# EAGLE design io-pack-2-1 (EAGLE 7.6.0)
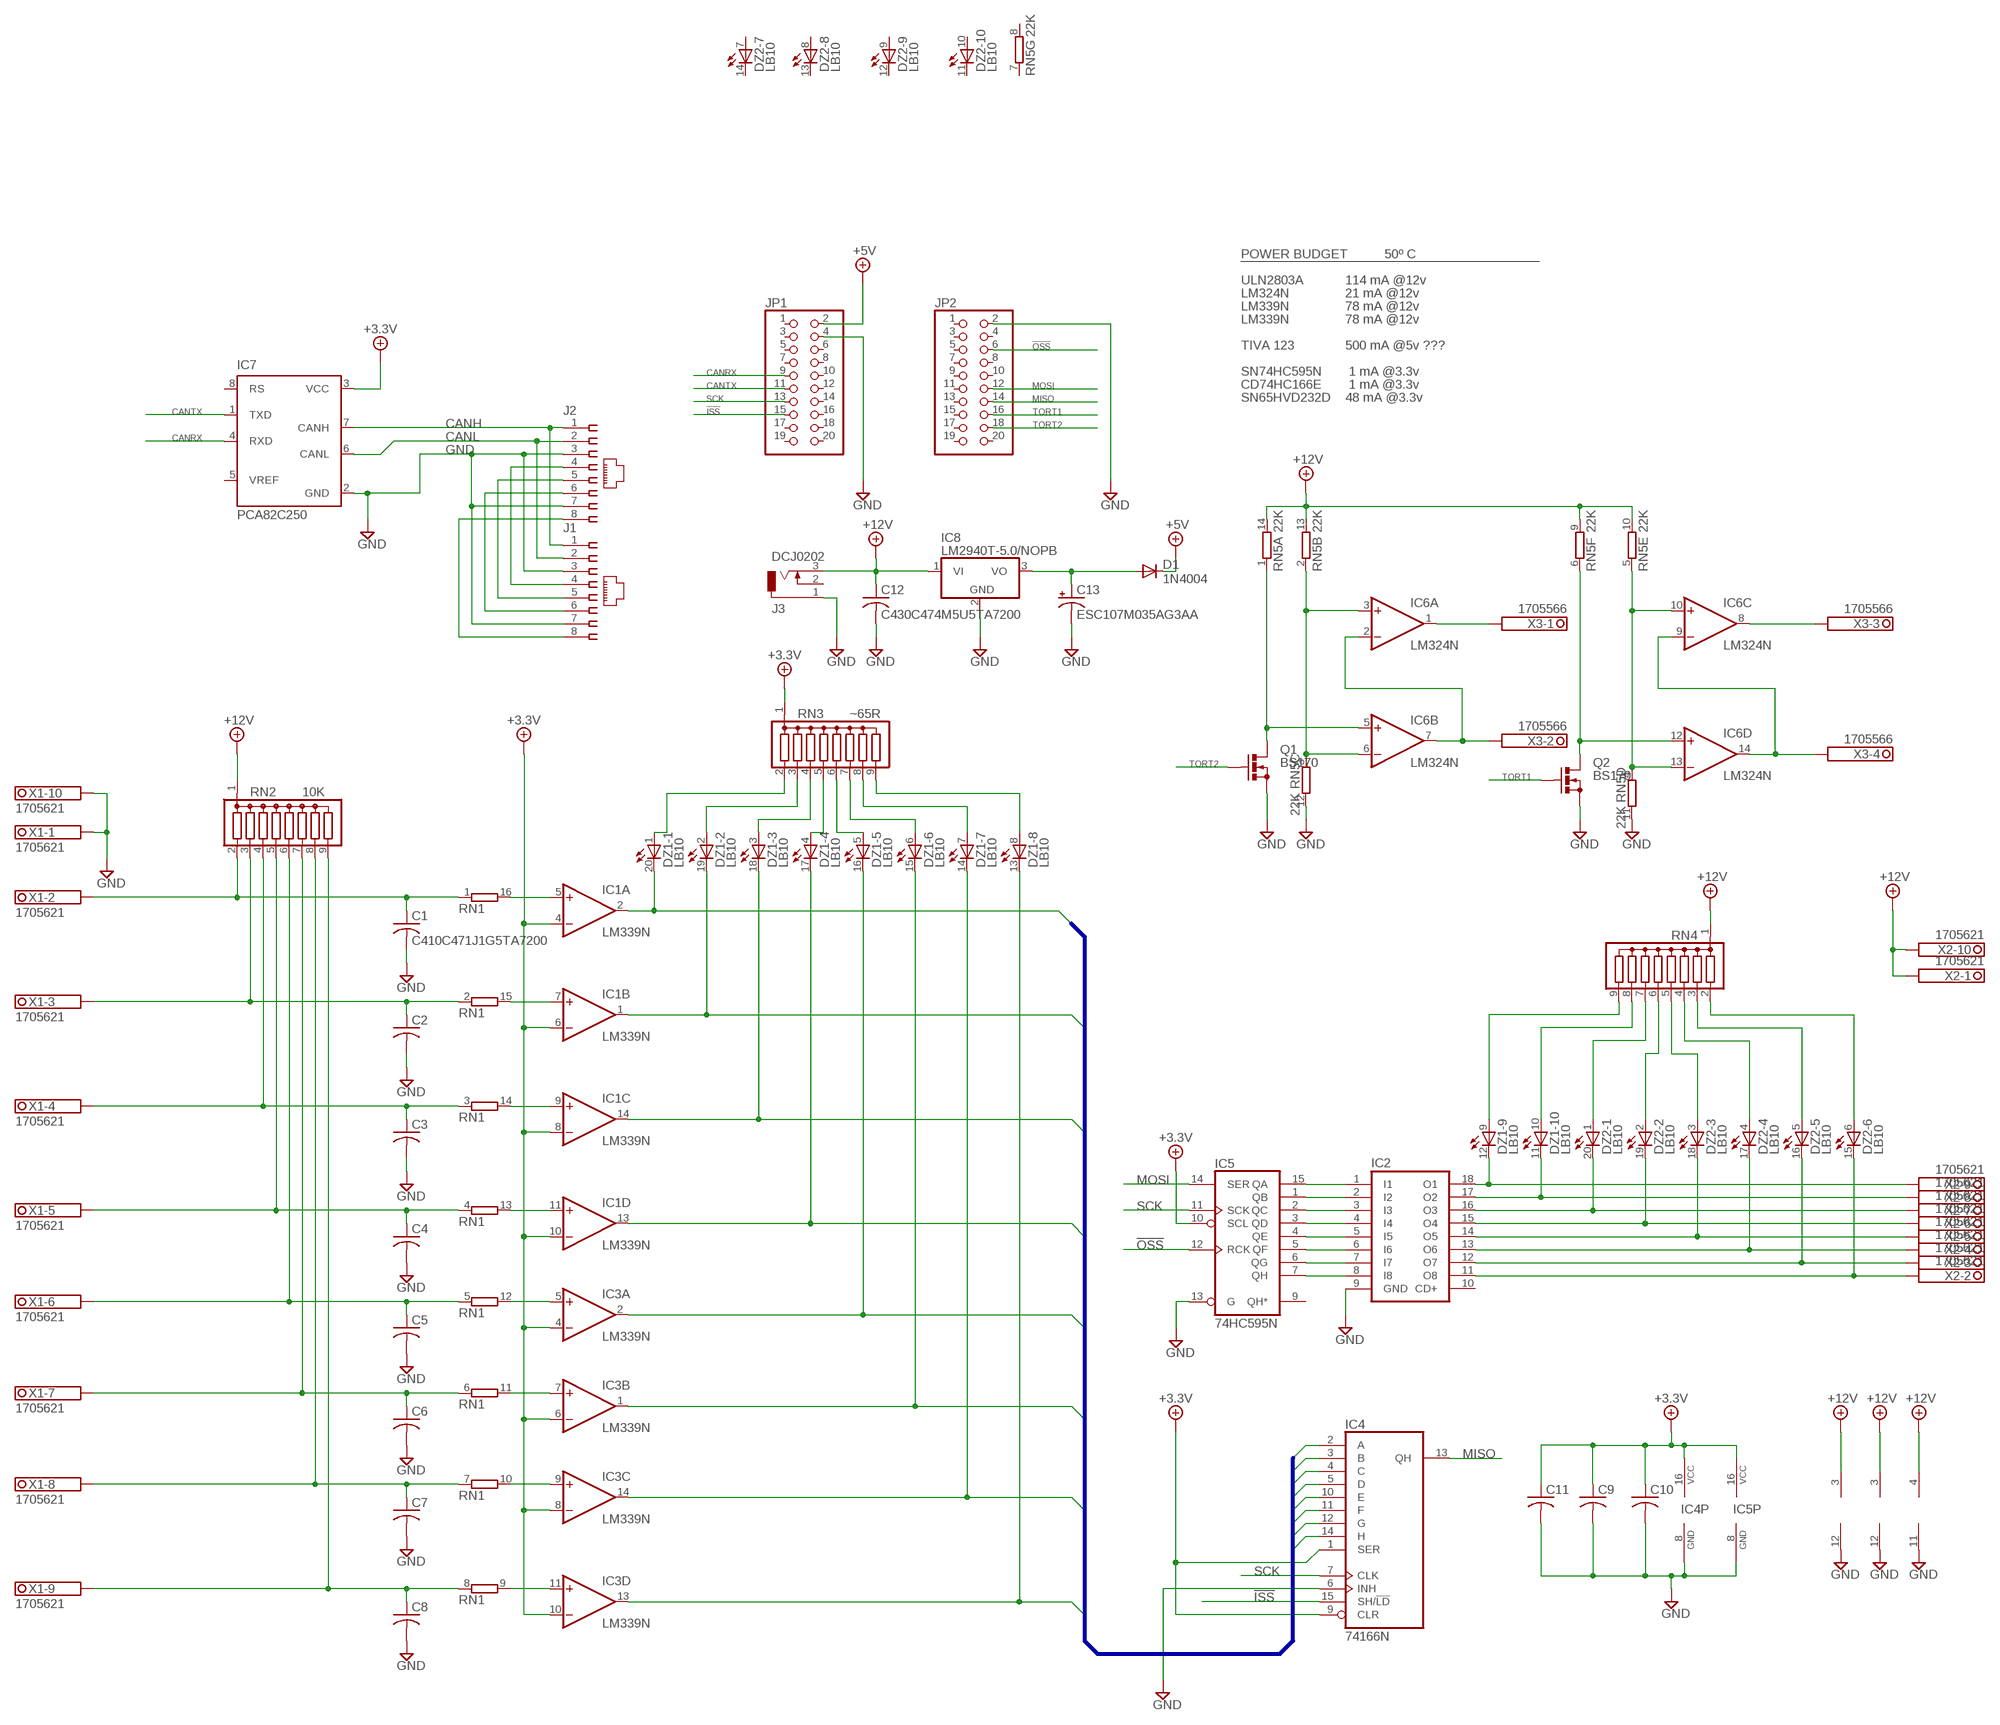
[diagram p0: schematic, sheet 1]

## Parts
C1  C410C471J1G5TA7200  C-US050-025X075  [C050-025X075]
C2  C-US050-025X075  [C050-025X075]
C3  C-US050-025X075  [C050-025X075]
C4  C-US050-025X075  [C050-025X075]
C5  C-US050-025X075  [C050-025X075]
C6  C-US050-025X075  [C050-025X075]
C7  C-US050-025X075  [C050-025X075]
C8  C-US050-025X075  [C050-025X075]
C9  C-US050-025X075  [C050-025X075]
C10  C-US050-025X075  [C050-025X075]
C11  C-US050-025X075  [C050-025X075]
C12  C430C474M5U5TA7200  C-US075-032X103  [C075-032X103]
C13  ESC107M035AG3AA  CPOL-USE3.5-8  [E3,5-8]
D1  1N4004  [DO41-10]
DZ1  LB10  [LB10]
DZ2  LB10  [LB10]
IC1  LM339N  [DIL14]
IC2  ULN2803A  [DIL18]
IC3  LM339N  [DIL14]
IC4  74166N  [DIL16]
IC5  74HC595N  74LS595N  [DIL16]
IC6  LM324N  [DIL14]
IC7  PCA82C250  [DIL08]
IC8  LM2940T-5.0/NOPB  7805TV  [TO220V]
J1  555164-1  [555164-1]
J2  555164-1  [555164-1]
J3  DCJ0202  [DCJ0202]
JP1  PINHD-2X10  [2X10]
JP2  PINHD-2X10  [2X10]
Q1  BS170  [SOT54E]
Q2  BS170  [SOT54E]
RN1  8R-P  [DIL16]
RN2  10K  G08R  [SIL9]
RN3  ~65R  G08R  [SIL9]
RN4  G08R  [SIL9]
RN5  22K  7R-N  [DIL14]
X1  1705621  [1705621]
X2  1705621  [1705621]
X3  1705566  [1705566]

## Nets
!ISS: IC4.15(SH/!LD) JP1.15
!OSS: IC5.12(RCK) JP2.6
+3.3V: C9.1 C10.1 C11.1 IC1.4(A:-IN) IC1.6(B:-IN) IC1.8(C:-IN) IC1.10(D:-IN) IC3.4(A:-IN) IC3.6(B:-IN) IC3.8(C:-IN) IC3.10(D:-IN) IC4.1(SER) IC4.9(CLR) IC4.16(VCC) IC5.10(SCL) IC5.16(VCC) IC7.3(VCC) RN3.1
+5V: D1.C JP1.2
+12V: C12.1 IC1.3(P:V+) IC3.3(P:V+) IC6.4(P:V+) IC8.1(VI) J3.3 RN2.1 RN4.1 RN5.9 RN5.10 RN5.13 RN5.14 X2.1.1 X2.1.2 X2.10.1 X2.10.2
CANH: IC7.7(CANH) J1.1 J2.1
CANL: IC7.6(CANL) J1.2 J2.2
CANRX: IC7.4(RXD) JP1.9
CANTX: IC7.1(TXD) JP1.11
GND: C1.2 C2.2 C3.2 C4.2 C5.2 C6.2 C7.2 C8.2 C9.2 C10.2 C11.2 C12.2 C13.- IC1.12(P:GND) IC2.9(GND) IC3.12(P:GND) IC4.6(INH) IC4.8(GND) IC5.8(GND) IC5.13(G) IC6.11(P:V-) IC7.2(GND) IC8.2(GND) J1.3 J1.7 J2.3 J2.7 J3.1 JP1.4 JP2.2 Q1.S Q2.S RN5.11 RN5.12 X1.1.1 X1.1.2 X1.10.1 X1.10.2
IN0: DZ1.20(-1:C) IC1.2(A:OUT) IC4.2(A)
IN1: DZ1.19(-2:C) IC1.1(B:OUT) IC4.3(B)
IN2: DZ1.18(-3:C) IC1.14(C:OUT) IC4.4(C)
IN3: DZ1.17(-4:C) IC1.13(D:OUT) IC4.5(D)
IN4: DZ1.16(-5:C) IC3.2(A:OUT) IC4.10(E)
IN5: DZ1.15(-6:C) IC3.1(B:OUT) IC4.11(F)
IN6: DZ1.14(-7:C) IC3.14(C:OUT) IC4.12(G)
IN7: DZ1.13(-8:C) IC3.13(D:OUT) IC4.14(H)
MISO: IC4.13(QH) JP2.14
MOSI: IC5.14(SER) JP2.12
N$2: C13.+ D1.A IC8.3(VO)
N$4: J1.4 J2.4
N$5: J1.5 J2.5
N$6: J1.6 J2.6
N$9: IC1.5(A:+IN) RN1.16
N$10: IC1.7(B:+IN) RN1.15
N$11: IC1.9(C:+IN) RN1.14
N$12: IC1.11(D:+IN) RN1.13
N$13: DZ1.1(-1:A) RN3.2
N$14: DZ1.2(-2:A) RN3.3
N$15: DZ1.3(-3:A) RN3.4
N$16: DZ1.4(-4:A) RN3.5
N$17: DZ1.5(-5:A) RN3.6
N$18: DZ1.6(-6:A) RN3.7
N$19: DZ1.7(-7:A) RN3.8
N$20: DZ1.8(-8:A) RN3.9
N$21: IC2.1(I1) IC5.15(QA)
N$22: IC2.2(I2) IC5.1(QB)
N$23: IC2.3(I3) IC5.2(QC)
N$24: IC2.4(I4) IC5.3(QD)
N$25: C1.1 RN1.1 RN2.2 X1.2.1 X1.2.2
N$26: C2.1 RN1.2 RN2.3 X1.3.1 X1.3.2
N$27: C3.1 RN1.3 RN2.4 X1.4.1 X1.4.2
N$28: C4.1 RN1.4 RN2.5 X1.5.1 X1.5.2
N$29: IC3.5(A:+IN) RN1.12
N$30: IC3.7(B:+IN) RN1.11
N$31: IC3.9(C:+IN) RN1.10
N$32: IC3.11(D:+IN) RN1.9
N$33: C5.1 RN1.5 RN2.6 X1.6.1 X1.6.2
N$34: C6.1 RN1.6 RN2.7 X1.7.1 X1.7.2
N$35: C7.1 RN1.7 RN2.8 X1.8.1 X1.8.2
N$36: C8.1 RN1.8 RN2.9 X1.9.1 X1.9.2
N$37: IC2.5(I5) IC5.4(QE)
N$38: IC2.6(I6) IC5.5(QF)
N$39: IC2.7(I7) IC5.6(QG)
N$40: IC2.8(I8) IC5.7(QH)
N$41: IC6.3(A:+IN) IC6.6(B:-IN) RN5.2 RN5.3
N$42: DZ1.12(-9:C) IC2.18(O1) X2.9.1 X2.9.2
N$43: DZ1.9(-9:A) RN4.9
N$44: DZ1.10(-10:A) RN4.8
N$45: DZ2.1(-1:A) RN4.7
N$46: DZ2.2(-2:A) RN4.6
N$47: DZ2.3(-3:A) RN4.5
N$48: DZ2.4(-4:A) RN4.4
N$49: DZ2.5(-5:A) RN4.3
N$50: DZ2.6(-6:A) RN4.2
N$51: DZ1.11(-10:C) IC2.17(O2) X2.8.1 X2.8.2
N$52: DZ2.20(-1:C) IC2.16(O3) X2.7.1 X2.7.2
N$53: DZ2.19(-2:C) IC2.15(O4) X2.6.1 X2.6.2
N$54: DZ2.18(-3:C) IC2.14(O5) X2.5.1 X2.5.2
N$55: DZ2.17(-4:C) IC2.13(O6) X2.4.1 X2.4.2
N$56: DZ2.16(-5:C) IC2.12(O7) X2.3.1 X2.3.2
N$57: DZ2.15(-6:C) IC2.11(O8) X2.2.1 X2.2.2
N$59: IC6.5(B:+IN) Q1.D RN5.1
N$60: IC6.2(A:-IN) IC6.7(B:OUT) X3.2.1 X3.2.2
N$61: IC6.12(D:+IN) Q2.D RN5.6
N$62: IC6.10(C:+IN) IC6.13(D:-IN) RN5.4 RN5.5
N$63: IC6.9(C:-IN) IC6.14(D:OUT) X3.4.1 X3.4.2
N$64: IC6.1(A:OUT) X3.1.1 X3.1.2
N$65: IC6.8(C:OUT) X3.3.1 X3.3.2
PWR_POS: J1.8 J2.8
SCK: IC4.7(CLK) IC5.11(SCK) JP1.13
TORT1: JP2.16 Q2.G
TORT2: JP2.18 Q1.G
Unconnected: DZ2.7(-7:A) DZ2.8(-8:A) DZ2.9(-9:A) DZ2.10(-10:A) DZ2.11(-10:C) DZ2.12(-9:C) DZ2.13(-8:C) DZ2.14(-7:C) IC2.10(CD+) IC5.9(QH*) IC7.5(VREF) IC7.8(RS) J3.2 JP1.1 JP1.3 JP1.5 JP1.6 JP1.7 JP1.8 JP1.10 JP1.12 JP1.14 JP1.16 JP1.17 JP1.18 JP1.19 JP1.20 JP2.1 JP2.3 JP2.4 JP2.5 JP2.7 JP2.8 JP2.9 JP2.10 JP2.11 JP2.13 JP2.15 JP2.17 JP2.19 JP2.20 RN5.7 RN5.8

## Buses
IN[0..7]

## Notes on the sheet
- POWER BUDGET | 50º C
- ULN2803A | 114 mA @12v
- LM324N | 21 mA @12v
- LM339N | 78 mA @12v
- LM339N | 78 mA @12v
- TIVA 123 | 500 mA @5v ???
- SN74HC595N | 1 mA @3.3v
- CD74HC166E | 1 mA @3.3v
- SN65HVD232D | 48 mA @3.3v

## Library data of the parts
C1-C12 = rcl:C-US: CAPACITOR, American symbol
C13 = rcl:CPOL-US: POLARIZED CAPACITOR, American symbol
D1 = diode:1N4004: DIODE general purpose rectifier, 1 A
DZ1 DZ2 = led:LB10: LED BLOCK 10-LED bar graph, DIL, Siemens
IC1 IC3 = linear:LM339: Low Power Low Offset Voltage Quad Comparators with open collector; LM139/LM239/LM339/LM2901/LM3302
IC2 = uln-udn:ULN2803A: DRIVER ARRAY
IC4 = 74xx-us:74*166: 8-bit parallel load SHIFT REGISTER
IC5 = 74xx-us:74*595: 8-bit SHIFT REGISTER, output latch
IC6 = linear:LM324: OP AMP
IC7 = micro-philips:PCA82C250: CAN CONTROLLER INTERFACE; OC_FARNELL: 3692358; OC_NEWARK: unknown
IC8 = linear:78*: Positive VOLTAGE REGULATOR Source: http://cache.national.com/ds/LM/LM78L05.pdf http://www.fairchildsemi.com/ds/LM/LM7805.pdf
J1 J2 = con-amp:555164-1: AMP connector
J3 = con-jack:DCJ0202: DC POWER JACK Source: DCJ0202.pdf; OC_FARNELL: unknown; OC_NEWARK: unknown
JP1 JP2 = pinhead:PINHD-2X10: PIN HEADER
Q1 Q2 = transistor-small-signal:BS170: N-CHANNEL MOS FET
RN1 = resistor-dil:8R-P: DIL RESISTOR; OC_FARNELL: unknown; OC_NEWARK: unknown
RN2-RN4 = resistor-sil:G08R: SIL RESISTOR; OC_FARNELL: unknown; OC_NEWARK: unknown
RN5 = resistor-dil:7R-N: DIL RESISTOR; OC_FARNELL: unknown; OC_NEWARK: unknown
X1 X2 = con-phoenix-3.81:1705621: MKDSD 1,5/10-3,81 Printklemme Nennstrom: 8 A Bemessungsspannung: 200 V Raster: 3,81 mm Polzahl: 12 Montageart: Löten Anschlussart: Schraubanschluss Anschlussrichtung vom Leiter zur Platine: 0° Source: http://eshop.phoenixcontact.com .. 1705621.pdf; OC_FARNELL: unknown; OC_NEWARK: unknown
X3 = con-phoenix-3.81:1705566: MKDSD 1,5/ 4-3,81 Printklemme Nennstrom: 8 A Bemessungsspannung: 200 V Raster: 3,81 mm Polzahl: 4 Montageart: Löten Anschlussart: Schraubanschluss Anschlussrichtung vom Leiter zur Platine: 0° Source: http://eshop.phoenixcontact.com .. 1705566.pdf; OC_FARNELL: unknown; OC_NEWARK: unknown

## Board
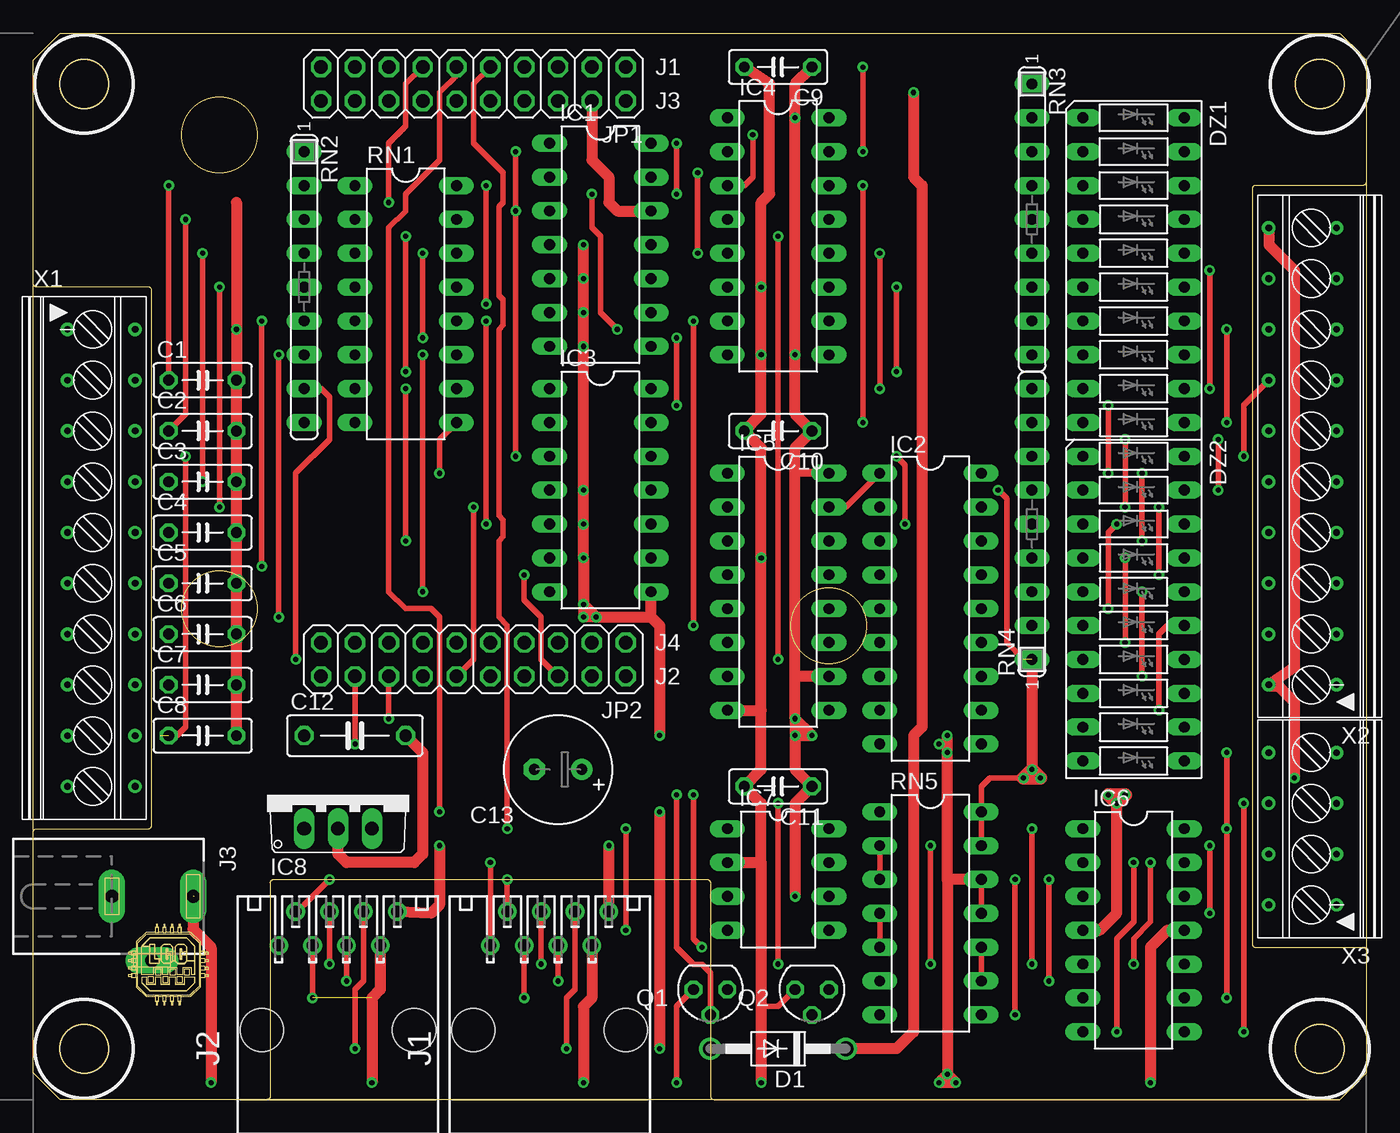
[diagram p1: board, top side]
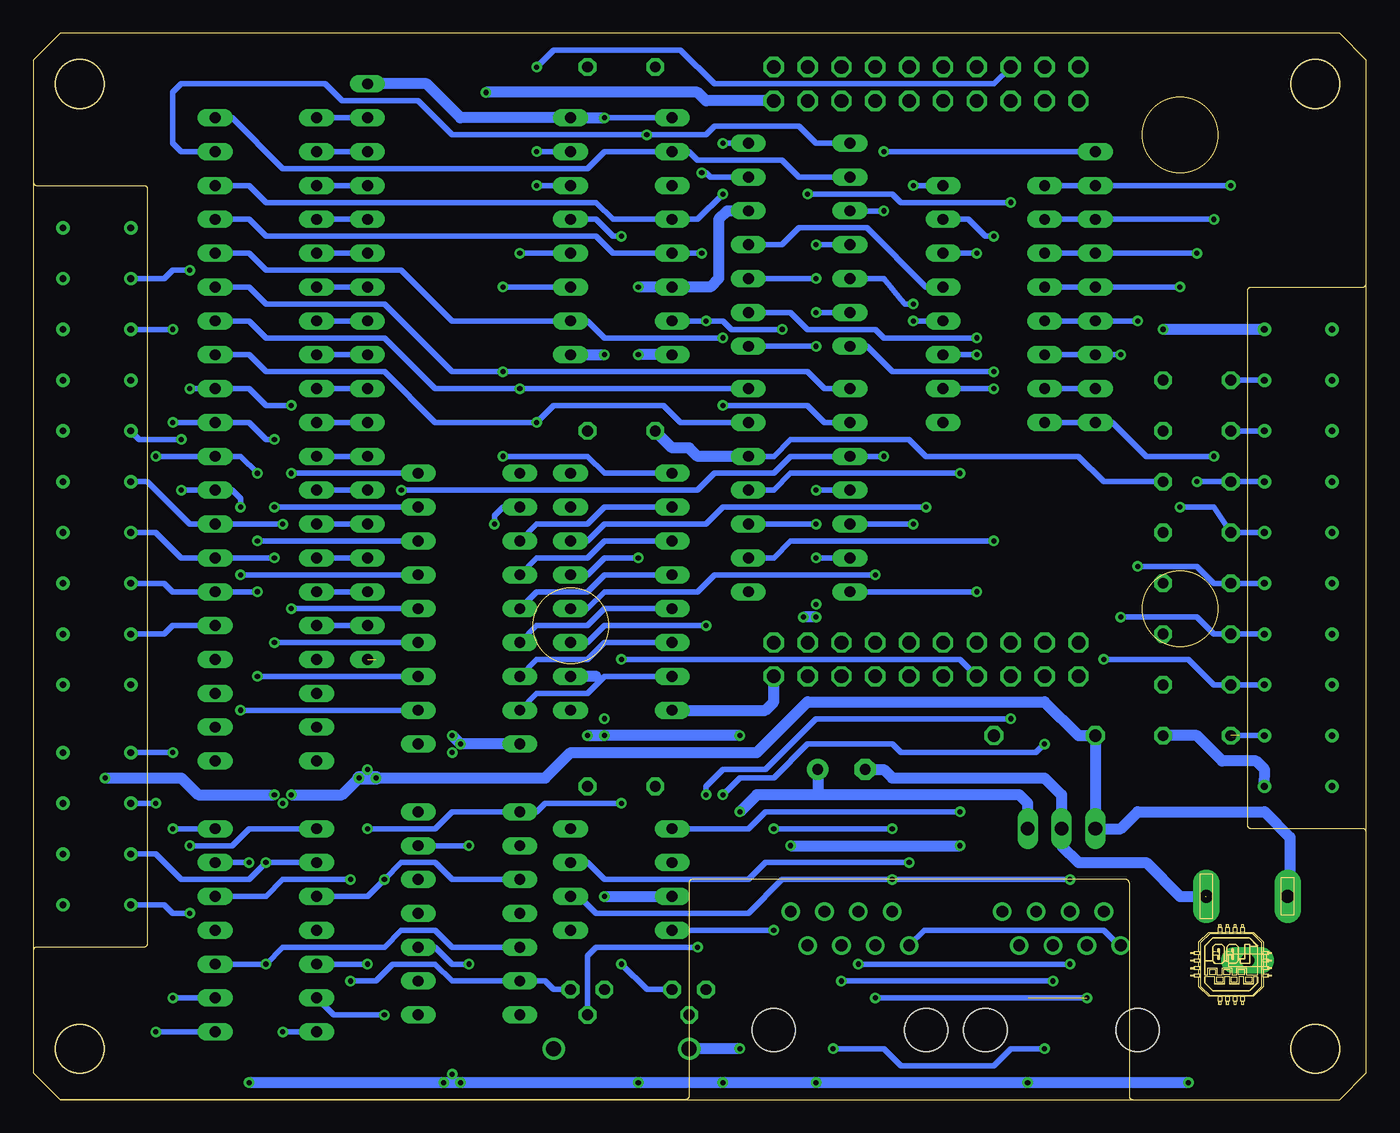
[diagram p2: board, bottom side, seen from below]

Size 100 x 80 mm. Coordinates in mm from the lower left corner, seen from the top.
Outline: 98,0 2,0 0,2 0,78 2,80 98,80 100,78 100,2 98,0
Copper layers (1*16): Top 0.035mm / dielectric 1.5mm / Bottom 0.035mm
Design rules "default": minimum track width 10mil, minimum drill 24mil, track to track 8mil, track to pad 8mil, pad to pad 8mil, via to via 8mil, smd to smd 8mil, copper to edge 40mil, drill to drill 8mil, minimum pad ring 10mil, minimum via ring 8mil, stop-mask expansion 4mil, vias tented up to drill 0mil, thermal gap 10mil
Holes 3.66 mm at 3.81,76.2 96.52,76.2 96.52,3.81 3.81,3.81 3.81,76.2
tKeepout: area 0.4,72.8 to 7.2,79.6; area 93.1,72.8 to 99.9,79.6; area 93.1,0.4 to 99.9,7.2; area 0.4,0.4 to 7.2,7.2; area 11.4,22.9 to 34.3,25.4
bKeepout: area 0.4,72.8 to 7.2,79.6; area 93.1,72.8 to 99.9,79.6; area 93.1,0.4 to 99.9,7.2; area 0.4,0.4 to 7.2,7.2
Milling: area 2,74.4 to 5.6,78; area 94.7,74.4 to 98.3,78; area 94.7,2 to 98.3,5.6; area 2,2 to 5.6,5.6; area 11.1,69.6 to 16.8,75.2; area 11.1,34 to 16.8,39.7; area 56.9,32.7 to 62.5,38.4; area 9.2,12.9 to 9.3,13.2; area 9.1,12.5 to 9.4,12.9; area 9.7,12.5 to 10,12.9; area 10.3,12.5 to 10.5,12.9; area 10.8,12.5 to 11.1,12.9; 39 more areas; 229 lines

### Footprints (pad centres in the part's own frame; a part is rotated, then mirrored left to right if it is on the bottom)
C050-025X075 = drill 0.813 octagon: 1 -2.54,0; 2 2.54,0
C075-032X103 = drill 0.914 octagon: 1 -3.81,0; 2 3.81,0
E3,5-8 = drill 0.813 pad 1.6: + -1.778,0 | drill 0.813 pad 1.6 octagon: - 1.778,0
DO41-10 = drill 1.118: A 5.08,0; C -5.08,0
LB10 = drill 0.813 long: 1 -11.43,-3.81; 2 -8.89,-3.81; 3 -6.35,-3.81; 4 -3.81,-3.81; 5 -1.27,-3.81; 6 1.27,-3.81; 7 3.81,-3.81; 8 6.35,-3.81; 9 8.89,-3.81; 10 11.43,-3.81; 11 11.43,3.81; 12 8.89,3.81; 13 6.35,3.81; 14 3.81,3.81; 15 1.27,3.81; 16 -1.27,3.81; 17 -3.81,3.81; 18 -6.35,3.81; 19 -8.89,3.81; 20 -11.43,3.81
DIL14 = drill 0.813 long: 1 -7.62,-3.81; 2 -5.08,-3.81; 3 -2.54,-3.81; 4 0,-3.81; 5 2.54,-3.81; 6 5.08,-3.81; 7 7.62,-3.81; 8 7.62,3.81; 9 5.08,3.81; 10 2.54,3.81; 11 0,3.81; 12 -2.54,3.81; 13 -5.08,3.81; 14 -7.62,3.81
DIL18 = drill 0.813 long: 1 -10.16,-3.81; 2 -7.62,-3.81; 3 -5.08,-3.81; 4 -2.54,-3.81; 5 0,-3.81; 6 2.54,-3.81; 7 5.08,-3.81; 8 7.62,-3.81; 9 10.16,-3.81; 10 10.16,3.81; 11 7.62,3.81; 12 5.08,3.81; 13 2.54,3.81; 14 0,3.81; 15 -2.54,3.81; 16 -5.08,3.81; 17 -7.62,3.81; 18 -10.16,3.81
DIL16 = drill 0.813 long: 1 -8.89,-3.81; 2 -6.35,-3.81; 3 -3.81,-3.81; 4 -1.27,-3.81; 5 1.27,-3.81; 6 3.81,-3.81; 7 6.35,-3.81; 8 8.89,-3.81; 9 8.89,3.81; 10 6.35,3.81; 11 3.81,3.81; 12 1.27,3.81; 13 -1.27,3.81; 14 -3.81,3.81; 15 -6.35,3.81; 16 -8.89,3.81
DIL08 = drill 0.813 long: 1 -3.81,-3.81; 2 -1.27,-3.81; 3 1.27,-3.81; 4 3.81,-3.81; 5 3.81,3.81; 6 1.27,3.81; 7 -1.27,3.81; 8 -3.81,3.81
TO220V = drill 1.016 long: 1 -2.54,-2.54; 2 0,-2.54; 3 2.54,-2.54
555164-1 = drill 0.889: 1 -4.445,5.207; 2 -3.175,7.747; 3 -1.905,5.207; 4 -0.635,7.747; 5 0.635,5.207; 6 1.905,7.747; 7 3.175,5.207; 8 4.445,7.747 | hole 3.251: -5.715,-1.143; 5.715,-1.143
DCJ0202 = drill 1 pad 2 long: 1 0,3.1; 2 4.8,0; 3 0,-3
2X10 = drill 1.016 octagon: 1 -11.43,-1.27; 2 -11.43,1.27; 3 -8.89,-1.27; 4 -8.89,1.27; 5 -6.35,-1.27; 6 -6.35,1.27; 7 -3.81,-1.27; 8 -3.81,1.27; 9 -1.27,-1.27; 10 -1.27,1.27; 11 1.27,-1.27; 12 1.27,1.27; 13 3.81,-1.27; 14 3.81,1.27; 15 6.35,-1.27; 16 6.35,1.27; 17 8.89,-1.27; 18 8.89,1.27; 19 11.43,-1.27; 20 11.43,1.27
SOT54E = drill 0.813 octagon: D -1.27,0; G 0,1.905; S 1.27,0
SIL9 = drill 0.813 long: 1 -10.16,0; 2 -7.62,0; 3 -5.08,0; 4 -2.54,0; 5 0,0; 6 2.54,0; 7 5.08,0; 8 7.62,0; 9 10.16,0
1705621 = drill 0.5 pad 0.9: 1.1 -17.145,-1.25; 1.2 -17.145,3.83; 2.1 -13.335,-1.25; 2.2 -13.335,3.83; 3.1 -9.525,-1.25; 3.2 -9.525,3.83; 4.1 -5.715,-1.25; 4.2 -5.715,3.83; 5.1 -1.905,-1.25; 5.2 -1.905,3.83; 6.1 1.905,-1.25; 6.2 1.905,3.83; 7.1 5.715,-1.25; 7.2 5.715,3.83; 8.1 9.525,-1.25; 8.2 9.525,3.83; 9.1 13.335,-1.25; 9.2 13.335,3.83; 10.1 17.145,-1.25; 10.2 17.145,3.83
1705566 = drill 0.5 pad 0.9: 1.1 -5.715,-1.25; 1.2 -5.715,3.83; 2.1 -1.905,-1.25; 2.2 -1.905,3.83; 3.1 1.905,-1.25; 3.2 1.905,3.83; 4.1 5.715,-1.25; 4.2 5.715,3.83

### Placement (x,y rotation side)
C1  12.7,53.98 0 top
C2  12.7,50.16 0 top
C3  12.7,46.35 0 top
C4  12.7,42.55 0 top
C5  12.7,38.73 0 top
C6  12.7,34.92 0 top
C7  12.7,31.11 0 top
C8  12.7,27.3 0 top
C9  55.88,77.47 180 top
C10  55.88,50.16 180 top
C11  55.88,23.5 180 top
C12  24.13,27.3 0 top
C13  39.37,24.77 180 top
D1  55.88,3.81 180 top
DZ1  82.55,62.23 270 top
DZ2  82.55,36.83 270 top
IC1  42.55,64.14 270 top
IC2  67.31,36.83 270 top
IC3  42.55,45.72 270 top
IC4  55.88,64.77 270 top
IC5  55.88,38.1 270 top
IC6  82.55,12.7 270 top
IC7  55.88,16.51 270 top
IC8  22.86,22.86 0 top
J1  38.73,6.35 0 top
J2  22.86,6.35 0 top
J3  8.89,15.24 270 top
JP1  33.02,76.2 180 top
JP2  33.02,33.02 180 top
Q1  50.8,8.26 180 top
Q2  58.42,8.26 180 top
RN1  27.94,59.69 270 top
RN2  20.32,60.96 270 top
RN3  74.93,66.04 270 top
RN4  74.93,43.18 90 top
RN5  67.31,13.97 270 top
X1  3.81,40.64 270 top
X2  96.52,48.26 90 top
X3  96.52,20.32 90 top

### Tracks (layer width: path | path; a pad name or v marks a point on that pad's centre or on a via)
!ISS  (via drill 0.38)
  Top 0.406: v62.23,77.47 v62.23,71.12
  Bottom 0.406: JP1.15 27.94,76.2 48.9,76.2 51.44,78.74 60.96,78.74 v62.23,77.47 | v62.23,71.12 IC4.15
!OSS  (via drill 0.38)
  Top 0.406: JP2.6 38.1,33.02 38.1,36.2 36.83,37.47 v36.83,39.37
  Bottom 0.406: v36.83,39.37 48.9,39.37 50.16,38.1 57.15,38.1 58.42,36.83 IC5.12
+3.3V  (via drill 0.38)
  Top 0.61: IC5.16 57.15,46.99
  Top 0.813: v41.27,64.14 v41.27,61.59 v41.27,59.05 v41.27,56.52 v41.27,45.72 v41.27,43.18 v41.27,40.64 v41.27,37.15 | IC5.10 57.15,31.75 | 57.15,31.75 57.15,46.99 57.15,48.9 C10.1 57.15,51.44 v57.15,55.88 v57.15,73.66 57.15,76.2 C9.1 | v41.27,37.15 v41.27,36.2 v42.23,36.2 | v42.23,36.2 46.35,36.2 | 46.35,36.2 46.99,35.56 v46.99,27.3 | v41.27,37.15 v42.23,36.2 | v57.15,28.57 57.15,31.75 | v57.15,27.3 57.15,24.77 C11.1 57.15,22.23 v57.15,15.24 | v57.15,28.57 v58.42,27.3 v57.15,27.3 | v57.15,28.57 v57.15,27.3 | 46.35,36.2 IC3.8
  Bottom 0.406: IC1.4 v41.27,64.14 | v41.27,59.05 IC1.6 | v41.27,40.64 IC3.6 | v41.27,45.72 IC3.4 | IC1.8 v41.27,56.52 | IC1.10 v41.27,61.59 | IC3.10 v41.27,43.18 | v57.15,73.66 IC4.1
  Bottom 0.813: IC4.9 v57.15,55.88 | v57.15,73.66 IC4.16 67.94,73.66 70.48,76.2 RN3.1 | v41.27,36.2 v42.23,36.2 | v46.99,27.3 v58.42,27.3 v57.15,27.3 | 57.78,31.75 IC5.10 | v57.15,15.24 IC7.3
+5V  (via drill 0.38)
  Top 0.813: v66.04,75.56 66.04,69.22 66.67,68.58 66.67,27.94 66.04,27.3 66.04,5.08 64.77,3.81 D1.C
  Bottom 0.813: JP1.2 49.53,74.93 50.16,75.56 v66.04,75.56
+12V  (via drill 0.38)  (1 unrouted)
  Top 0.406: v36.2,71.12 v36.2,66.67 v36.2,48.26 | 74.3,33.02 73.03,34.29 73.03,45.09 v72.39,45.72 | RN5.13 RN5.14 71.12,23.5 71.75,24.13 v74.3,24.13 | RN5.9 RN5.10 | v67.31,19.05 v67.31,10.16
  Top 0.813: X2.10.2 92.71,64.14 94.61,62.23 94.61,32.41 X2.1.2 | RN4.1 v74.93,24.77 | IC6.4 80.01,12.7 81.28,13.97 v81.28,22.23 | 93.34,31.11 94.61,29.84 v94.61,24.13
  Top 1.016: X2.1.2 93.34,31.11 | v74.93,24.77 v75.56,24.13 v74.3,24.13 v74.93,24.77 | v80.64,22.86 v81.92,22.86 v81.28,22.23 v80.64,22.86
  Bottom 0.406: RN2.1 v36.2,71.12 | v36.2,48.26 IC3.3 43.18,48.26 44.45,46.99 48.9,46.99 50.16,45.72 v72.39,45.72 | IC1.3 v36.2,66.67 | RN5.13 v67.31,19.05 | v67.31,10.16 68.58,10.16 69.85,11.43 RN5.10
  Bottom 0.813: v94.61,24.13 88.9,24.13 87.63,22.86 v81.92,22.86 | v75.56,24.13 76.83,22.86 v80.64,22.86 | v74.3,24.13 61.59,24.13 59.69,26.04 45.72,26.04 41.91,29.84 24.13,29.84 21.59,27.3 C12.1 IC8.1 18.41,20.32 17.14,21.59 7.62,21.59 5.71,19.68 5.71,15.41 J3.3
  Bottom 1.016: v75.56,24.13 v74.3,24.13
CANH  (via drill 0.38)
  Top 0.406: J1.1 v34.29,17.78
  Bottom 0.406: IC7.7 58.42,17.78 57.15,16.51 46.35,16.51 45.09,17.78 v34.29,17.78 | J2.1 18.54,11.56 19.68,12.7 33.15,12.7 J1.1
CANL  (via drill 0.38)
  Top 0.406: v22.23,16.51 20.32,14.61 J2.2 | J1.2 v35.56,16.51
  Bottom 0.406: IC7.6 59.05,15.24 57.78,13.97 46.35,13.97 43.81,16.51 v35.56,16.51 v22.23,16.51
CANRX  (via drill 0.38)
  Top 0.406: JP1.9 33.02,76.2 33.02,71.75 35.24,69.53 35.24,67.31 34.92,66.99 34.92,60.33 35.24,60.01 35.24,58.1 34.92,57.78 34.92,43.81 35.24,43.5 35.24,42.23 34.92,41.91 34.92,36.2 35.56,35.56 v35.56,20.32 | v44.45,20.32 v44.45,12.7
  Bottom 0.406: v35.56,20.32 v44.45,20.32 | v44.45,12.7 IC7.4
CANTX  (via drill 0.38)
  Top 0.406: JP1.11 31.75,76.83 30.48,75.56 30.48,70.48 27.94,67.94 27.94,66.67 26.67,65.41 26.67,38.1 27.94,36.83 29.84,36.83 30.48,36.2 v30.48,21.59
  Bottom 0.406: v30.48,21.59 45.09,21.59 46.35,20.32 IC7.1
GND  (via drill 0.38)  (2 unrouted)
  Top 0.406: RN5.11 RN5.12 | J2.3 v20.95,7.62 | v36.83,7.62 J1.3 | Q2.S 55.88,6.99 54.61,6.99 | Q1.S 48.26,6.99 v48.26,1.27
  Top 0.813: 15.24,67.31 v15.24,57.78 C1.2 C2.2 C3.2 C4.2 C5.2 C6.2 C7.2 C8.2 | IC5.8 54.61,29.21 | 54.61,29.21 v54.61,40.64 54.61,48.9 C10.2 54.61,51.44 v54.61,55.88 v54.61,60.96 54.61,67.31 55.24,67.94 55.24,76.2 C9.2 | 54.61,17.78 54.61,22.23 C11.2 54.61,24.77 54.61,29.21 | IC7.2 54.61,17.78 | RN5.12 68.58,16.51 | 68.58,16.51 v68.58,26.04 v68.58,27.3 | 68.58,16.51 v68.58,1.91 | v68.58,1.91 68.58,1.27 | IC6.11 85.09,12.7 83.82,11.43 v83.82,1.27 | J2.7 26.04,8.26 25.4,7.62 v25.4,1.27 | J1.7 41.91,7.62 41.27,6.99 v41.27,1.27 | v68.58,1.91 v67.94,1.27 v69.22,1.27 v68.58,1.91 | JP1.4 41.91,70.48 43.18,69.22 43.18,67.31 43.81,66.67 IC1.12 | 54.61,17.78 54.61,6.99 v54.61,1.27 | J3.1 11.99,12.78 13.34,11.43 v13.34,1.27 | C12.2 29.21,26.04 29.21,18.41 28.57,17.78 23.5,17.78 22.86,18.41 IC8.2
  Bottom 0.406: IC3.12 44.45,48.26 43.18,49.53 34.29,49.53 33.02,48.26 21.59,48.26 19.68,46.35 C3.2 | IC5.13 58.42,39.37 57.15,40.64 v54.61,40.64 | v20.95,7.62 v36.83,7.62
  Bottom 0.813: X1.10.2 7.62,24.77 8.26,25.4 10.79,25.4 12.7,27.3 C8.2 | X1.1.2 v15.24,57.78 | IC3.12 50.16,48.26 50.8,48.9 52.07,48.9 C10.2 | IC4.8 v54.61,55.88 | v54.61,60.96 IC4.6 49.21,60.96 48.58,61.59 48.58,66.04 47.94,66.67 IC1.12 | v83.82,1.27 v69.22,1.27 v67.94,1.27 v54.61,1.27 v48.26,1.27 v41.27,1.27 v25.4,1.27 v13.34,1.27 | IC2.9 v67.94,26.67 v68.58,27.3 | IC5.8 45.09,29.21 44.45,29.84 JP2.2 | 12.06,15.24 13.97,15.24 16.51,17.78 21.59,17.78 22.86,19.05 IC8.2 22.86,22.86 24.13,24.13 35.56,24.13 36.2,24.77 C13.-
IN0
  Bottom 0.406: IC1.2 42.55,69.22 43.81,70.48 50.16,70.48 50.8,71.12 IC4.2 57.15,71.12 58.42,69.85 81.28,69.85 85.09,73.66 DZ1.20
IN1  (via drill 0.38)
  Top 0.406: v53.98,72.39 53.98,69.22 53.34,68.58 IC4.3
  Bottom 0.406: IC1.1 41.27,71.75 42.55,73.03 48.9,73.03 49.53,72.39 v53.98,72.39 68.58,72.39 71.12,74.93 76.83,74.93 78.11,76.2 88.9,76.2 89.53,75.56 89.53,71.75 88.9,71.12 DZ1.19
IN2  (via drill 0.38)
  Top 0.406: v48.26,71.75 v48.26,67.94
  Bottom 0.406: IC1.14 v48.26,71.75 | v48.26,67.94 50.16,66.04 IC4.4 56.52,66.04 57.78,67.31 82.55,67.31 83.82,68.58 DZ1.18
IN3  (via drill 0.38)
  Top 0.406: v49.85,69.53 v49.85,63.5
  Bottom 0.406: IC1.13 49.21,69.22 49.53,69.53 v49.85,69.53 | v49.85,63.5 IC4.5 56.52,63.5 57.78,64.77 82.55,64.77 83.82,66.04 DZ1.17
IN4  (via drill 0.38)
  Top 0.406: v48.26,52.07 v48.26,57.15
  Bottom 0.406: IC3.2 40.64,50.8 41.91,52.07 v48.26,52.07 | v48.26,57.15 57.15,57.15 58.42,58.42 IC4.10 68.58,58.42 72.39,62.23 82.55,62.23 83.82,63.5 DZ1.16
IN5  (via drill 0.38)
  Top 0.406: v64.77,60.96 v64.77,54.61
  Bottom 0.406: IC3.1 40.64,53.34 41.91,54.61 v64.77,54.61 68.58,54.61 73.66,59.69 82.55,59.69 83.82,60.96 DZ1.15 | IC4.11 v64.77,60.96
IN6  (via drill 0.38)
  Top 0.406: v63.5,63.5 v63.5,53.34
  Bottom 0.406: IC3.14 v63.5,53.34 69.85,53.34 73.66,57.15 82.55,57.15 83.82,58.42 DZ1.14 | IC4.12 v63.5,63.5
IN7  (via drill 0.38)
  Top 0.406: v62.23,68.58 v62.23,50.8
  Bottom 0.406: IC3.13 51.44,50.8 52.7,52.07 60.96,52.07 v62.23,50.8 69.85,50.8 73.66,54.61 82.55,54.61 83.82,55.88 DZ1.13 | IC4.14 v62.23,68.58
MISO  (via drill 0.38)
  Top 0.406: v55.88,33.02 v55.88,64.77
  Bottom 0.406: JP2.14 30.48,33.02 v55.88,33.02 | v55.88,64.77 56.52,64.77 57.78,66.04 IC4.13
MOSI  (via drill 0.38)
  Top 0.406: v33.02,44.45 33.02,33.02 JP2.12
  Bottom 0.406: IC5.14 58.42,41.91 57.15,43.18 49.53,43.18 48.26,44.45 v33.02,44.45
N$2  (via drill 0.38)
  Top 0.813: v46.99,21.59 v46.99,3.81
  Bottom 0.813: IC8.3 25.4,22.23 26.04,22.86 41.27,22.86 | 41.27,22.86 45.72,22.86 v46.99,21.59 | C13.+ 41.15,22.99 41.27,22.86 | v46.99,3.81 D1.A
N$4  (via drill 0.38)
  Top 0.406: J2.4 v22.23,10.16 | v38.1,10.16 J1.4
  Bottom 0.406: v22.23,10.16 v38.1,10.16
N$5  (via drill 0.38)
  Top 0.406: J2.5 v23.5,8.89 | v39.37,8.89 J1.5
  Bottom 0.406: v23.5,8.89 v39.37,8.89
N$6  (via drill 0.38)
  Top 0.406: J2.6 24.77,8.89 24.13,8.26 v24.13,3.81 | v40.01,3.81 40.01,7.62 40.64,8.26 J1.6
  Bottom 0.406: v24.13,3.81 26.67,3.81 27.94,2.54 34.92,2.54 36.2,3.81 v40.01,3.81
N$9  (via drill 0.38)
  Top 0.406: v33.97,68.58 v33.97,59.69
  Bottom 0.406: RN1.16 v33.97,68.58 | v33.97,59.69 34.61,59.69 34.92,60.01 36.2,61.59 IC1.5
N$10  (via drill 0.38)
  Top 0.406: v27.94,64.77 v27.94,54.61
  Bottom 0.406: RN1.15 29.84,66.04 28.57,64.77 v27.94,64.77 | v27.94,54.61 35.56,54.61 37.47,56.52 IC1.7
N$11  (via drill 0.38)
  Top 0.406: v29.21,63.5 v29.21,57.15
  Bottom 0.406: RN1.14 v29.21,63.5 | v29.21,57.15 36.2,57.15 36.83,57.78 41.91,57.78 43.18,59.05 IC1.9
N$12
  Bottom 0.406: RN1.13 33.02,60.96 37.47,65.41 42.55,65.41 43.81,64.14 IC1.11
N$13
  Bottom 0.406: RN3.2 DZ1.1
N$14
  Bottom 0.406: RN3.3 DZ1.2
N$15
  Bottom 0.406: RN3.4 DZ1.3
N$16
  Bottom 0.406: RN3.5 DZ1.4
N$17
  Bottom 0.406: RN3.6 DZ1.5
N$18
  Bottom 0.406: RN3.7 DZ1.6
N$19
  Bottom 0.406: RN3.8 DZ1.7
N$20
  Bottom 0.406: RN3.9 DZ1.8
N$21
  Top 0.406: IC5.15 60.96,44.45 IC2.1
N$22  (via drill 0.38)
  Top 0.406: v64.77,48.26 65.41,47.62 v65.41,43.18
  Bottom 0.406: IC5.1 57.15,46.99 58.42,48.26 v64.77,48.26 | v65.41,43.18 65.41,43.81 64.77,44.45 IC2.2
N$23
  Bottom 0.406: IC5.2 57.15,44.45 58.42,43.18 62.23,43.18 IC2.3
N$24
  Bottom 0.406: IC5.3 57.15,41.91 58.42,40.64 62.23,40.64 IC2.4
N$25  (via drill 0.38)
  Top 0.406: v10.16,68.58 C1.1
  Bottom 0.406: X1.2.2 C1.1 | RN1.1 RN2.2 v10.16,68.58
N$26  (via drill 0.38)
  Top 0.406: C2.1 11.43,51.44 v11.43,66.04
  Bottom 0.406: X1.3.2 C2.1 | RN1.2 RN2.3 v11.43,66.04
N$27  (via drill 0.38)
  Top 0.406: v12.7,63.5 v12.7,46.35
  Bottom 0.406: X1.4.2 C3.1 v12.7,46.35 | RN1.3 RN2.4 v12.7,63.5
N$28  (via drill 0.38)
  Top 0.406: v13.97,60.96 v13.97,44.45
  Bottom 0.406: X1.5.2 C4.1 11.43,44.45 v13.97,44.45 | RN1.4 RN2.5 v13.97,60.96
N$29  (via drill 0.38)
  Top 0.406: v33.97,58.42 v33.97,43.18
  Bottom 0.406: RN1.12 v33.97,58.42 | v33.97,43.18 IC3.5
N$30  (via drill 0.38)
  Top 0.406: v29.21,55.88 v29.21,38.1
  Bottom 0.406: RN1.11 v29.21,55.88 | v29.21,38.1 IC3.7
N$31  (via drill 0.38)
  Top 0.406: v27.94,53.34 v27.94,41.91
  Bottom 0.406: RN1.10 v27.94,53.34 | v27.94,41.91 43.18,41.91 44.45,40.64 IC3.9
N$32  (via drill 0.38)
  Top 0.406: RN1.9 30.48,49.53 v30.48,46.99
  Bottom 0.406: v30.48,46.99 43.18,46.99 44.45,45.72 IC3.11
N$33  (via drill 0.38)
  Top 0.406: v17.14,58.42 v17.14,40.01
  Bottom 0.406: X1.6.2 C5.1 11.43,38.73 12.7,40.01 v17.14,40.01 | RN1.5 RN2.6 v17.14,58.42
N$34  (via drill 0.38)
  Top 0.406: v18.41,55.88 v18.41,36.2
  Bottom 0.406: X1.7.2 C6.1 11.43,34.92 12.7,36.2 v18.41,36.2 | RN1.6 RN2.7 v18.41,55.88
N$35  (via drill 0.38)
  Top 0.406: v19.68,33.02 19.68,46.99 22.23,49.53 22.23,52.7 21.59,53.34 RN2.8
  Bottom 0.406: X1.8.2 C7.1 11.43,31.11 13.34,33.02 v19.68,33.02 | RN2.8 RN1.7
N$36  (via drill 0.38)  (1 unrouted)
  Top 0.406: v11.43,48.26 11.43,27.94 10.79,27.3 C8.1
  Bottom 0.406: X1.9.2 9.53,27.3 | RN1.8 RN2.9 19.05,50.8 16.51,48.26 v11.43,48.26
N$37
  Bottom 0.406: IC5.4 57.15,39.37 58.42,38.1 62.23,38.1 IC2.5
N$38
  Bottom 0.406: IC5.5 57.15,36.83 58.42,35.56 62.23,35.56 IC2.6
N$39
  Bottom 0.406: IC5.6 57.15,34.29 58.42,33.02 62.23,33.02 IC2.7
N$40
  Bottom 0.406: IC5.7 57.15,31.75 58.42,30.48 62.23,30.48 IC2.8
N$41  (via drill 0.38)
  Top 0.406: RN5.2 RN5.3 | v73.66,16.51 v73.66,6.35
  Bottom 0.406: IC6.3 74.93,15.24 v73.66,16.51 72.39,17.78 69.85,17.78 68.58,16.51 RN5.3 | IC6.6 77.47,6.35 v73.66,6.35
N$42  (via drill 0.38)
  Top 0.406: v88.27,53.34 v88.27,62.23 | v80.64,46.99 v80.64,52.07
  Bottom 0.406: IC2.18 v80.64,46.99 | v88.27,62.23 89.53,62.23 90.17,61.59 X2.9.2 | v80.64,52.07 82.55,52.07 83.82,53.34 DZ1.12 v88.27,53.34
N$43
  Bottom 0.406: RN4.9 DZ1.9
N$44
  Bottom 0.406: RN4.8 DZ1.10
N$45
  Bottom 0.406: RN4.7 DZ2.1
N$46
  Bottom 0.406: RN4.6 DZ2.2
N$47
  Bottom 0.406: RN4.5 DZ2.3
N$48
  Bottom 0.406: RN4.4 DZ2.4
N$49
  Bottom 0.406: RN4.3 DZ2.5
N$50
  Bottom 0.406: RN4.2 DZ2.6
N$51  (via drill 0.38)
  Top 0.406: v89.53,50.8 v89.53,57.78 | v81.92,44.45 v81.92,49.53
  Bottom 0.406: IC2.17 v81.92,44.45 | v89.53,57.78 X2.8.2 | v81.92,49.53 82.55,49.53 83.82,50.8 DZ1.11 v89.53,50.8
N$52  (via drill 0.38)
  Top 0.406: v83.19,41.91 v83.19,46.99 | v90.81,48.26 90.81,52.09 X2.7.2
  Bottom 0.406: IC2.16 v83.19,41.91 | v83.19,46.99 84.45,48.26 DZ2.20 v90.81,48.26
N$53  (via drill 0.38)
  Top 0.406: v84.45,39.37 v84.45,44.45 | v88.9,45.72 v88.9,49.53
  Bottom 0.406: IC2.15 v84.45,39.37 | v84.45,44.45 84.45,45.09 85.09,45.72 DZ2.19 v88.9,45.72 | v88.9,49.53 92.06,49.53 X2.6.2
N$54  (via drill 0.38)
  Top 0.406: v80.64,36.83 80.64,42.55 v81.28,43.18
  Bottom 0.406: IC2.14 v80.64,36.83 | v81.28,43.18 DZ2.18 88.27,43.18 91.44,46.35 X2.5.2
N$55  (via drill 0.38)
  Top 0.406: v81.92,34.29 v81.92,40.64
  Bottom 0.406: IC2.13 v81.92,34.29 | v81.92,40.64 DZ2.17 88.9,40.64 90.81,42.55 X2.4.2
N$56  (via drill 0.38)
  Top 0.406: v83.19,31.75 v83.19,38.1
  Bottom 0.406: IC2.12 v83.19,31.75 | v83.19,38.1 DZ2.16 89.53,38.1 90.17,38.73 X2.3.2
N$57  (via drill 0.38)
  Top 0.406: v84.45,29.21 84.45,34.92 85.09,35.56 DZ2.15
  Bottom 0.406: IC2.11 v84.45,29.21 | DZ2.15 89.53,35.56 90.17,34.92 X2.2.2
N$59  (via drill 0.38)
  Top 0.406: v74.93,10.16 v74.93,20.32 | v55.88,22.23 v55.88,10.16
  Bottom 0.406: IC6.5 v74.93,10.16 | v74.93,20.32 69.85,20.32 68.58,21.59 RN5.1 62.23,21.59 61.59,22.23 v55.88,22.23 | v55.88,10.16 53.98,8.26 Q1.D
N$60  (via drill 0.38)
  Top 0.406: v82.55,17.78 82.55,13.34 81.28,12.06 v81.28,5.08
  Bottom 0.406: IC6.7 v81.28,5.08 | IC6.2 v82.55,17.78 83.82,16.51 88.9,16.51 90.81,18.41 X3.2.2
N$61  (via drill 0.38)
  Top 0.406: v76.2,8.89 v76.2,16.51
  Bottom 0.406: v76.2,8.89 74.3,8.89 73.03,10.16 69.85,10.16 68.58,8.89 RN5.6 61.59,8.89 60.96,8.26 Q2.D | v76.2,16.51 81.28,16.51 82.55,15.24 IC6.12
N$62  (via drill 0.38)
  Top 0.406: RN5.4 RN5.5 | v83.82,17.78 83.82,13.34 82.55,12.06 v82.55,10.16
  Bottom 0.406: RN5.5 68.58,11.43 69.85,12.7 72.39,12.7 73.66,11.43 81.28,11.43 v82.55,10.16 IC6.10 | IC6.13 v83.82,17.78
N$63  (via drill 0.38)
  Top 0.406: v89.53,26.04 v89.53,20.32 v89.53,7.62
  Bottom 0.406: IC6.14 v89.53,20.32 | v89.53,26.04 X3.4.2 | IC6.9 v89.53,7.62
N$64  (via drill 0.38)
  Top 0.406: v88.27,19.05 v88.27,13.97
  Bottom 0.406: IC6.1 83.82,20.32 85.09,19.05 v88.27,19.05 | v88.27,13.97 89.53,13.97 90.17,14.61 X3.1.2
N$65  (via drill 0.38)
  Top 0.406: v90.81,22.23 v90.81,5.08
  Bottom 0.406: IC6.8 v90.81,5.08 | X3.3.2 v90.81,22.23
PWR_POS  (via drill 0.38)
  Top 0.813: J1.8 v43.18,19.05 | v30.48,19.05 30.48,14.61 29.84,13.97 J2.8
  Bottom 0.813: v43.18,19.05 v30.48,19.05
SCK  (via drill 0.38)
  Top 0.406: v49.53,58.42 v49.53,35.56 | JP1.13 27.94,76.2 27.94,73.03 26.67,71.75 v26.67,67.31 | v41.91,67.94 41.91,65.41 42.55,64.77 42.55,59.05 v43.81,57.78
  Bottom 0.406: IC4.7 v49.53,58.42 48.26,58.42 47.62,57.78 v43.81,57.78 | v49.53,35.56 57.15,35.56 58.42,34.29 IC5.11 | v26.67,67.31 34.92,67.31 35.56,67.94 v41.91,67.94
TORT1  (via drill 0.38)
  Top 0.406: JP2.16 v26.67,28.57 | v49.53,22.86 49.53,12.06 v50.16,11.43
  Bottom 0.406: v26.67,28.57 41.27,28.57 45.09,24.77 48.26,24.77 49.53,23.5 v49.53,22.86 | v50.16,11.43 57.78,11.43 58.42,10.79 Q2.G
TORT2  (via drill 0.38)
  Top 0.406: JP2.18 v24.13,26.67 | v48.26,22.86 48.26,11.43 49.53,10.16 50.16,10.16 50.8,9.53 Q1.G
  Bottom 0.406: v24.13,26.67 24.77,26.04 34.92,26.04 35.56,26.67 41.91,26.67 44.45,24.13 46.99,24.13 v48.26,22.86

### Text on the board
tPlace: J1 | J3 | J4 | J2
Document: To Do: / / Fix power vias from single to tripple. / Fix silk screen for all parts.
tDocu: 6-32 OR M3.5 x .6 / MOUNTING HOLE / (TYP. 4)
Tiva: Tiva Lauchpad Outline